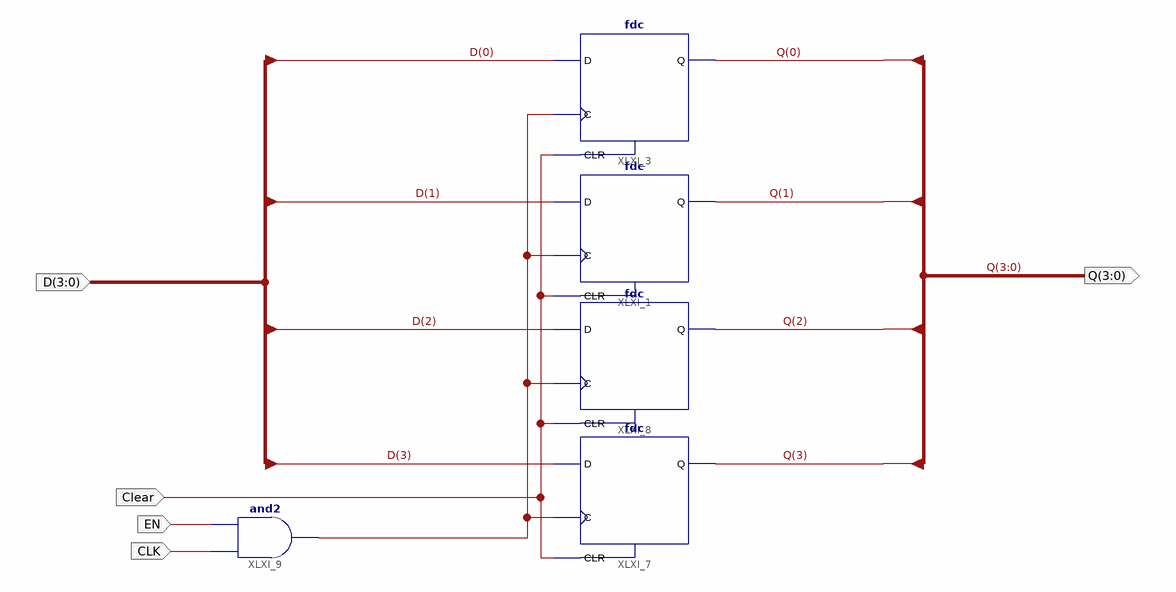
[diagram p0: schematic sheet 1]
// Xilinx ISE schematic Reg_4.sch (spartan3e) as structural Verilog: 5 symbols, 5 ports
module Reg_4 (
  input  CLK,
  input  EN,
  input  Clear,
  input  [3:0] D,
  output [3:0] Q
);

  wire XLXN_13;

  fdc XLXI_1 (.C(XLXN_13), .CLR(Clear), .D(D[1]), .Q(Q[1]));
  fdc XLXI_8 (.C(XLXN_13), .CLR(Clear), .D(D[2]), .Q(Q[2]));
  fdc XLXI_7 (.C(XLXN_13), .CLR(Clear), .D(D[3]), .Q(Q[3]));
  and XLXI_9 (XLXN_13, CLK, EN);
  fdc XLXI_3 (.C(XLXN_13), .CLR(Clear), .D(D[0]), .Q(Q[0]));
endmodule
